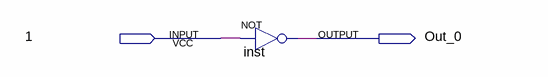
[diagram p0: schematic sheet]
// Quartus schematic D0.bdf as structural Verilog: 1 symbols, 2 pins
module D0 (
  input  \1 ,
  output Out_0
);

  not inst (Out_0, \1 );
endmodule
